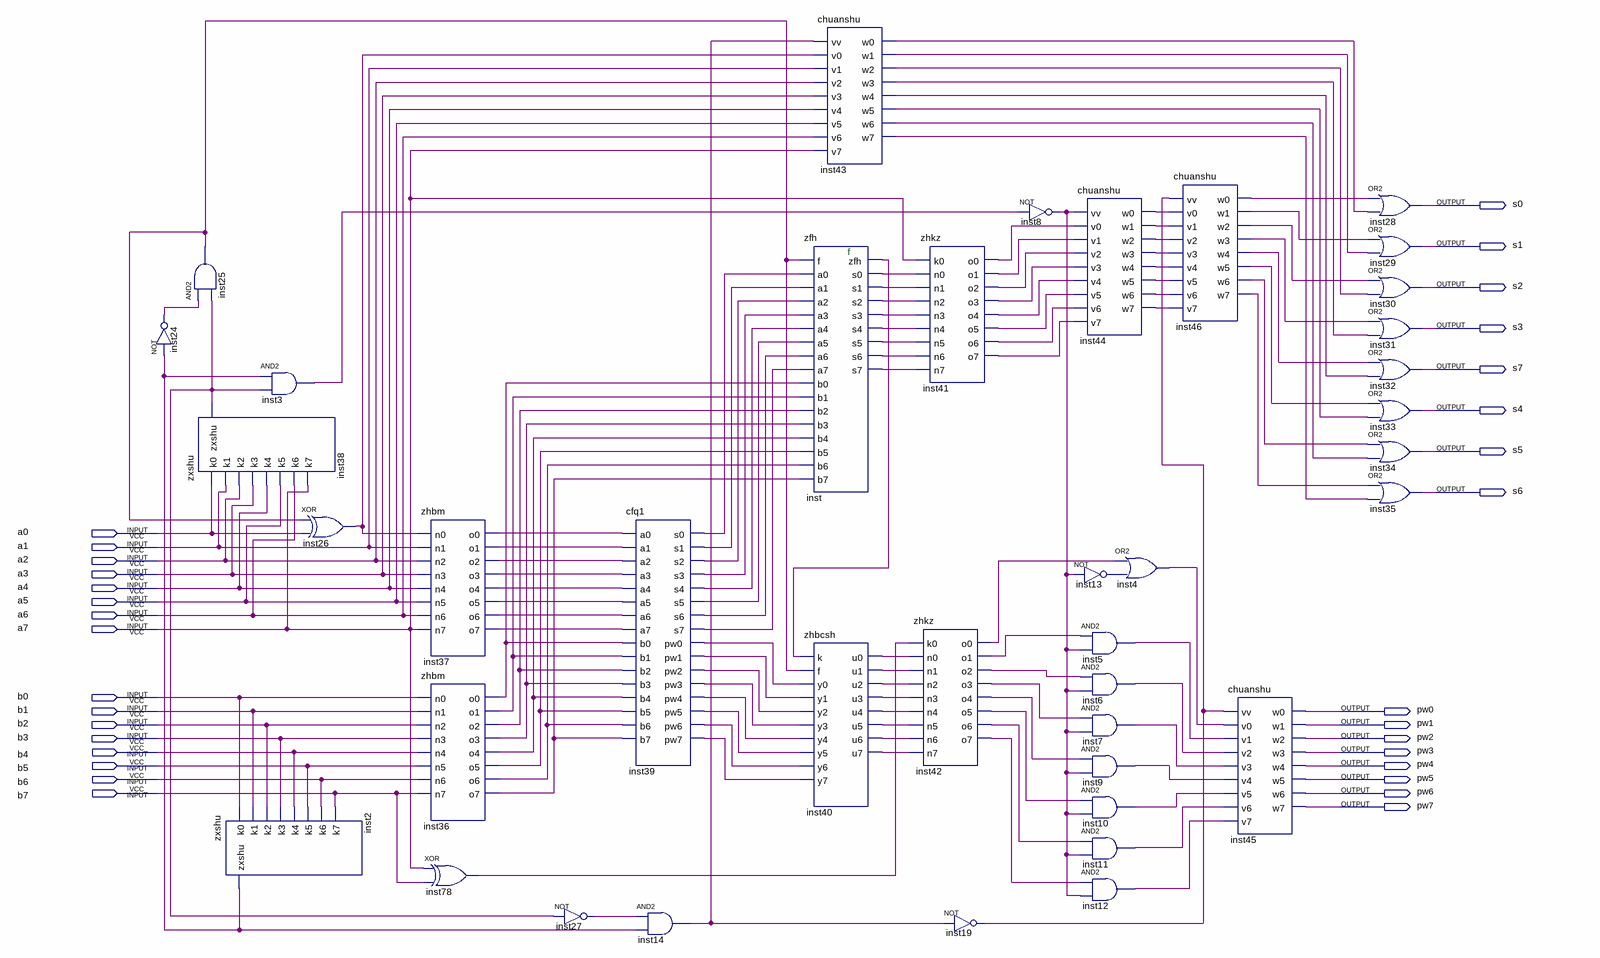
[diagram p0: schematic sheet]
// Quartus schematic cfq3.bdf as structural Verilog: 39 symbols, 32 pins
module cfq3 (
  input  a0,
  input  a1,
  input  a2,
  input  a3,
  input  a4,
  input  a5,
  input  a6,
  input  a7,
  input  b0,
  input  b1,
  input  b2,
  input  b3,
  input  b4,
  input  b5,
  input  b6,
  input  b7,
  output s0,
  output s1,
  output s2,
  output s3,
  output s7,
  output s4,
  output s5,
  output s6,
  output pw0,
  output pw1,
  output pw2,
  output pw3,
  output pw4,
  output pw5,
  output pw6,
  output pw7
);

  wire inst2_zxshu, inst3_out, inst4_out, inst5_out, inst6_out, inst7_out, inst8_out, inst9_out, inst10_out,
       inst11_out, inst12_out, inst13_out, inst14_out, inst19_out, inst24_out, inst25_out, inst26_out,
       inst27_out, inst36_o0, inst36_o1, inst36_o2, inst36_o3, inst36_o4, inst36_o5, inst36_o6, inst36_o7,
       inst37_o0, inst37_o1, inst37_o2, inst37_o3, inst37_o4, inst37_o5, inst37_o6, inst37_o7, inst38_zxshu,
       inst39_pw0, inst39_pw1, inst39_pw2, inst39_pw3, inst39_pw4, inst39_pw5, inst39_pw6, inst39_pw7,
       inst39_s0, inst39_s1, inst39_s2, inst39_s3, inst39_s4, inst39_s5, inst39_s6, inst39_s7, inst40_u0,
       inst40_u1, inst40_u2, inst40_u3, inst40_u4, inst40_u5, inst40_u6, inst40_u7, inst41_o0, inst41_o1,
       inst41_o2, inst41_o3, inst41_o4, inst41_o5, inst41_o6, inst41_o7, inst42_o0, inst42_o1, inst42_o2,
       inst42_o3, inst42_o4, inst42_o5, inst42_o6, inst42_o7, inst43_w0, inst43_w1, inst43_w2, inst43_w3,
       inst43_w4, inst43_w5, inst43_w6, inst43_w7, inst44_w0, inst44_w1, inst44_w2, inst44_w3, inst44_w4,
       inst44_w5, inst44_w6, inst44_w7, inst46_w0, inst46_w1, inst46_w2, inst46_w3, inst46_w4, inst46_w5,
       inst46_w6, inst46_w7, inst78_out, inst_s0, inst_s1, inst_s2, inst_s3, inst_s4, inst_s5, inst_s6,
       inst_s7, inst_zfh;

  not inst24 (inst24_out, inst2_zxshu);
  and inst25 (inst25_out, inst24_out, inst38_zxshu);
  zxshu inst38 (.k0(a0), .k1(a1), .k2(a2), .k3(a3), .k4(a4), .k5(a5), .k6(a6), .k7(a7), .zxshu(inst38_zxshu));
  zxshu inst2 (.k0(b0), .k1(b1), .k2(b2), .k3(b3), .k4(b4), .k5(b5), .k6(b6), .k7(b7), .zxshu(inst2_zxshu));
  and inst3 (inst3_out, inst2_zxshu, inst38_zxshu);
  xor inst26 (inst26_out, inst25_out, a0);
  zhbm inst37 (
    .n0(inst26_out), .n1(a1), .n2(a2), .n3(a3), .n4(a4), .n5(a5), .n6(a6), .n7(a7), .o0(inst37_o0),
    .o1(inst37_o1), .o2(inst37_o2), .o3(inst37_o3), .o4(inst37_o4), .o5(inst37_o5), .o6(inst37_o6),
    .o7(inst37_o7));
  zhbm inst36 (
    .n0(b0), .n1(b1), .n2(b2), .n3(b3), .n4(b4), .n5(b5), .n6(b6), .n7(b7), .o0(inst36_o0), .o1(inst36_o1),
    .o2(inst36_o2), .o3(inst36_o3), .o4(inst36_o4), .o5(inst36_o5), .o6(inst36_o6), .o7(inst36_o7));
  xor inst78 (inst78_out, a7, b7);
  not inst27 (inst27_out, inst38_zxshu);
  cfq1 inst39 (
    .a0(inst37_o0), .a1(inst37_o1), .a2(inst37_o2), .a3(inst37_o3), .a4(inst37_o4), .a5(inst37_o5),
    .a6(inst37_o6), .a7(inst37_o7), .b0(inst36_o0), .b1(inst36_o1), .b2(inst36_o2), .b3(inst36_o3),
    .b4(inst36_o4), .b5(inst36_o5), .b6(inst36_o6), .b7(inst36_o7), .s0(inst39_s0), .s1(inst39_s1),
    .s2(inst39_s2), .s3(inst39_s3), .s4(inst39_s4), .s5(inst39_s5), .s6(inst39_s6), .s7(inst39_s7),
    .pw0(inst39_pw0), .pw1(inst39_pw1), .pw2(inst39_pw2), .pw3(inst39_pw3), .pw4(inst39_pw4),
    .pw5(inst39_pw5), .pw6(inst39_pw6), .pw7(inst39_pw7));
  and inst14 (inst14_out, inst27_out, inst2_zxshu);
  chuanshu inst43 (
    .vv(inst14_out), .v0(inst26_out), .v1(a1), .v2(a2), .v3(a3), .v4(a4), .v5(a5), .v6(a6), .v7(a7),
    .w0(inst43_w0), .w1(inst43_w1), .w2(inst43_w2), .w3(inst43_w3), .w4(inst43_w4), .w5(inst43_w5),
    .w6(inst43_w6), .w7(inst43_w7));
  zfh inst (
    .f(inst25_out), .a0(inst39_s0), .a1(inst39_s1), .a2(inst39_s2), .a3(inst39_s3), .a4(inst39_s4),
    .a5(inst39_s5), .a6(inst39_s6), .a7(inst39_s7), .b0(inst36_o0), .b1(inst36_o1), .b2(inst36_o2),
    .b3(inst36_o3), .b4(inst36_o4), .b5(inst36_o5), .b6(inst36_o6), .b7(inst36_o7), .zfh(inst_zfh),
    .s0(inst_s0), .s1(inst_s1), .s2(inst_s2), .s3(inst_s3), .s4(inst_s4), .s5(inst_s5), .s6(inst_s6),
    .s7(inst_s7));
  zhbcsh inst40 (
    .k(inst_zfh), .f(inst25_out), .y0(inst39_pw0), .y1(inst39_pw1), .y2(inst39_pw2), .y3(inst39_pw3),
    .y4(inst39_pw4), .y5(inst39_pw5), .y6(inst39_pw6), .y7(inst39_pw7), .u0(inst40_u0), .u1(inst40_u1),
    .u2(inst40_u2), .u3(inst40_u3), .u4(inst40_u4), .u5(inst40_u5), .u6(inst40_u6), .u7(inst40_u7));
  zhkz inst41 (
    .k0(a7), .n0(inst_s0), .n1(inst_s1), .n2(inst_s2), .n3(inst_s3), .n4(inst_s4), .n5(inst_s5),
    .n6(inst_s6), .n7(inst_s7), .o0(inst41_o0), .o1(inst41_o1), .o2(inst41_o2), .o3(inst41_o3),
    .o4(inst41_o4), .o5(inst41_o5), .o6(inst41_o6), .o7(inst41_o7));
  zhkz inst42 (
    .k0(inst78_out), .n0(inst40_u0), .n1(inst40_u1), .n2(inst40_u2), .n3(inst40_u3), .n4(inst40_u4),
    .n5(inst40_u5), .n6(inst40_u6), .n7(inst40_u7), .o0(inst42_o0), .o1(inst42_o1), .o2(inst42_o2),
    .o3(inst42_o3), .o4(inst42_o4), .o5(inst42_o5), .o6(inst42_o6), .o7(inst42_o7));
  not inst19 (inst19_out, inst14_out);
  not inst8 (inst8_out, inst3_out);
  chuanshu inst44 (
    .vv(inst8_out), .v0(inst41_o0), .v1(inst41_o1), .v2(inst41_o2), .v3(inst41_o3), .v4(inst41_o4),
    .v5(inst41_o5), .v6(inst41_o6), .v7(inst41_o7), .w0(inst44_w0), .w1(inst44_w1), .w2(inst44_w2),
    .w3(inst44_w3), .w4(inst44_w4), .w5(inst44_w5), .w6(inst44_w6), .w7(inst44_w7));
  not inst13 (inst13_out, inst8_out);
  and inst5 (inst5_out, inst42_o1, inst8_out);
  and inst6 (inst6_out, inst42_o2, inst8_out);
  and inst7 (inst7_out, inst42_o3, inst8_out);
  and inst9 (inst9_out, inst42_o4, inst8_out);
  and inst10 (inst10_out, inst42_o5, inst8_out);
  and inst11 (inst11_out, inst42_o6, inst8_out);
  and inst12 (inst12_out, inst42_o7, inst8_out);
  or inst4 (inst4_out, inst42_o0, inst13_out);
  chuanshu inst46 (
    .vv(inst19_out), .v0(inst44_w0), .v1(inst44_w1), .v2(inst44_w2), .v3(inst44_w3), .v4(inst44_w4),
    .v5(inst44_w5), .v6(inst44_w6), .v7(inst44_w7), .w0(inst46_w0), .w1(inst46_w1), .w2(inst46_w2),
    .w3(inst46_w3), .w4(inst46_w4), .w5(inst46_w5), .w6(inst46_w6), .w7(inst46_w7));
  chuanshu inst45 (
    .vv(inst19_out), .v0(inst4_out), .v1(inst5_out), .v2(inst6_out), .v3(inst7_out), .v4(inst9_out),
    .v5(inst10_out), .v6(inst11_out), .v7(inst12_out), .w0(pw0), .w1(pw1), .w2(pw2), .w3(pw3), .w4(pw4),
    .w5(pw5), .w6(pw6), .w7(pw7));
  or inst28 (s0, inst46_w0, inst43_w0);
  or inst29 (s1, inst46_w1, inst43_w1);
  or inst30 (s2, inst46_w2, inst43_w2);
  or inst31 (s3, inst46_w3, inst43_w3);
  or inst32 (s7, inst46_w4, inst43_w4);
  or inst33 (s4, inst46_w5, inst43_w5);
  or inst34 (s5, inst46_w6, inst43_w6);
  or inst35 (s6, inst46_w7, inst43_w7);

  // Notes on the sheet:
  //   f
endmodule
